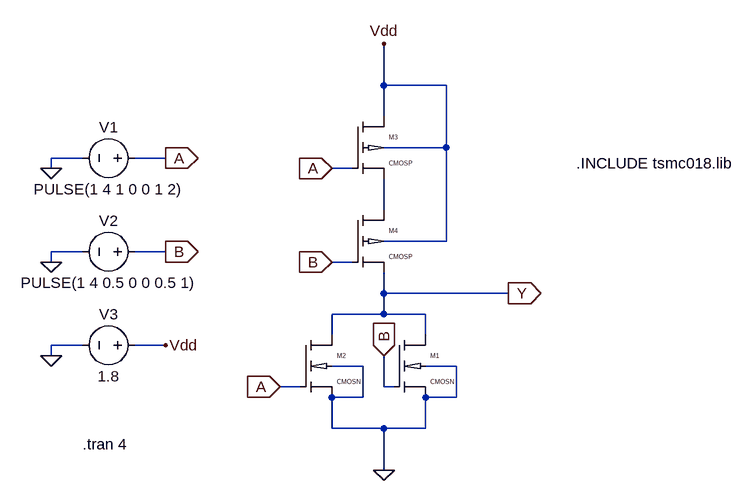
[diagram p0: schematic NOR_GATE.asc]
NOR_GATE.asc, the LTspice schematic file:
Version 4
SHEET 1 880 680
WIRE 256 -192 256 -256
WIRE 352 -192 256 -192
WIRE 256 -144 256 -192
WIRE 352 -96 352 -192
WIRE 352 -96 256 -96
WIRE -208 -80 -256 -80
WIRE -80 -80 -128 -80
WIRE -256 -64 -256 -80
WIRE 208 -64 176 -64
WIRE 256 0 256 -48
WIRE 352 48 352 -96
WIRE 352 48 256 48
WIRE -208 64 -256 64
WIRE -80 64 -128 64
WIRE -256 80 -256 64
WIRE 208 80 176 80
WIRE 256 128 256 96
WIRE 448 128 256 128
WIRE 256 160 256 128
WIRE 256 160 176 160
WIRE 320 160 256 160
WIRE 176 192 176 160
WIRE 320 192 320 160
WIRE -208 208 -256 208
WIRE -80 208 -128 208
WIRE -256 224 -256 208
WIRE 224 240 176 240
WIRE 368 240 320 240
WIRE 128 272 96 272
WIRE 256 272 256 224
WIRE 272 272 256 272
WIRE 224 288 224 240
WIRE 224 288 176 288
WIRE 368 288 368 240
WIRE 368 288 320 288
WIRE 176 336 176 288
WIRE 256 336 176 336
WIRE 320 336 320 288
WIRE 320 336 256 336
WIRE 256 400 256 336
FLAG 256 400 0
FLAG 176 -64 A
IOPIN 176 -64 In
FLAG 96 272 A
IOPIN 96 272 In
FLAG 176 80 B
IOPIN 176 80 In
FLAG 256 224 B
IOPIN 256 224 In
FLAG 448 128 Y
IOPIN 448 128 Out
FLAG 256 -256 Vdd
FLAG -256 224 0
FLAG -256 80 0
FLAG -256 -64 0
FLAG -80 -80 A
IOPIN -80 -80 Out
FLAG -80 64 B
IOPIN -80 64 Out
FLAG -80 208 Vdd
SYMBOL Ncmos 272 192 R0
SYMATTR InstName M1
SYMBOL Ncmos 128 192 R0
SYMATTR InstName M2
SYMBOL Pcmos 208 -144 R0
SYMATTR InstName M3
SYMBOL Pcmos 208 0 R0
SYMATTR InstName M4
SYMBOL voltage -112 -80 R90
WINDOW 0 -32 56 VBottom 2
WINDOW 3 32 56 VTop 2
WINDOW 123 0 0 Left 0
WINDOW 39 0 0 Left 0
SYMATTR InstName V1
SYMATTR Value PULSE(1 4 1 0 0 1 2)
SYMBOL voltage -112 64 R90
WINDOW 0 -32 56 VBottom 2
WINDOW 3 32 56 VTop 2
WINDOW 123 0 0 Left 0
WINDOW 39 0 0 Left 0
SYMATTR InstName V2
SYMATTR Value PULSE(1 4 0.5 0 0 0.5 1)
SYMBOL voltage -112 208 R90
WINDOW 0 -32 56 VBottom 2
WINDOW 3 32 56 VTop 2
WINDOW 123 0 0 Left 0
WINDOW 39 0 0 Left 0
SYMATTR InstName V3
SYMATTR Value 1.8
TEXT 552 -72 Left 2 !.INCLUDE tsmc018.lib
TEXT -208 360 Left 2 !.tran 4

The netlist it stands for:
* NOR_GATE.asc
M1 Y B 0 0 CMOSN
M2 Y A 0 0 CMOSN
M3 Vdd A N001 Vdd CMOSP
M4 N001 B Y Vdd CMOSP
V1 A 0 PULSE(1 4 1 0 0 1 2)
V2 B 0 PULSE(1 4 0.5 0 0 0.5 1)
V3 Vdd 0 1.8
.model NMOS NMOS
.model PMOS PMOS
.lib standard.mos
.INCLUDE tsmc018.lib
.tran 4
.lib tsmc018.lib
.backanno
.end